# EAGLE design BSPD REV2 (EAGLE 9.6.2)
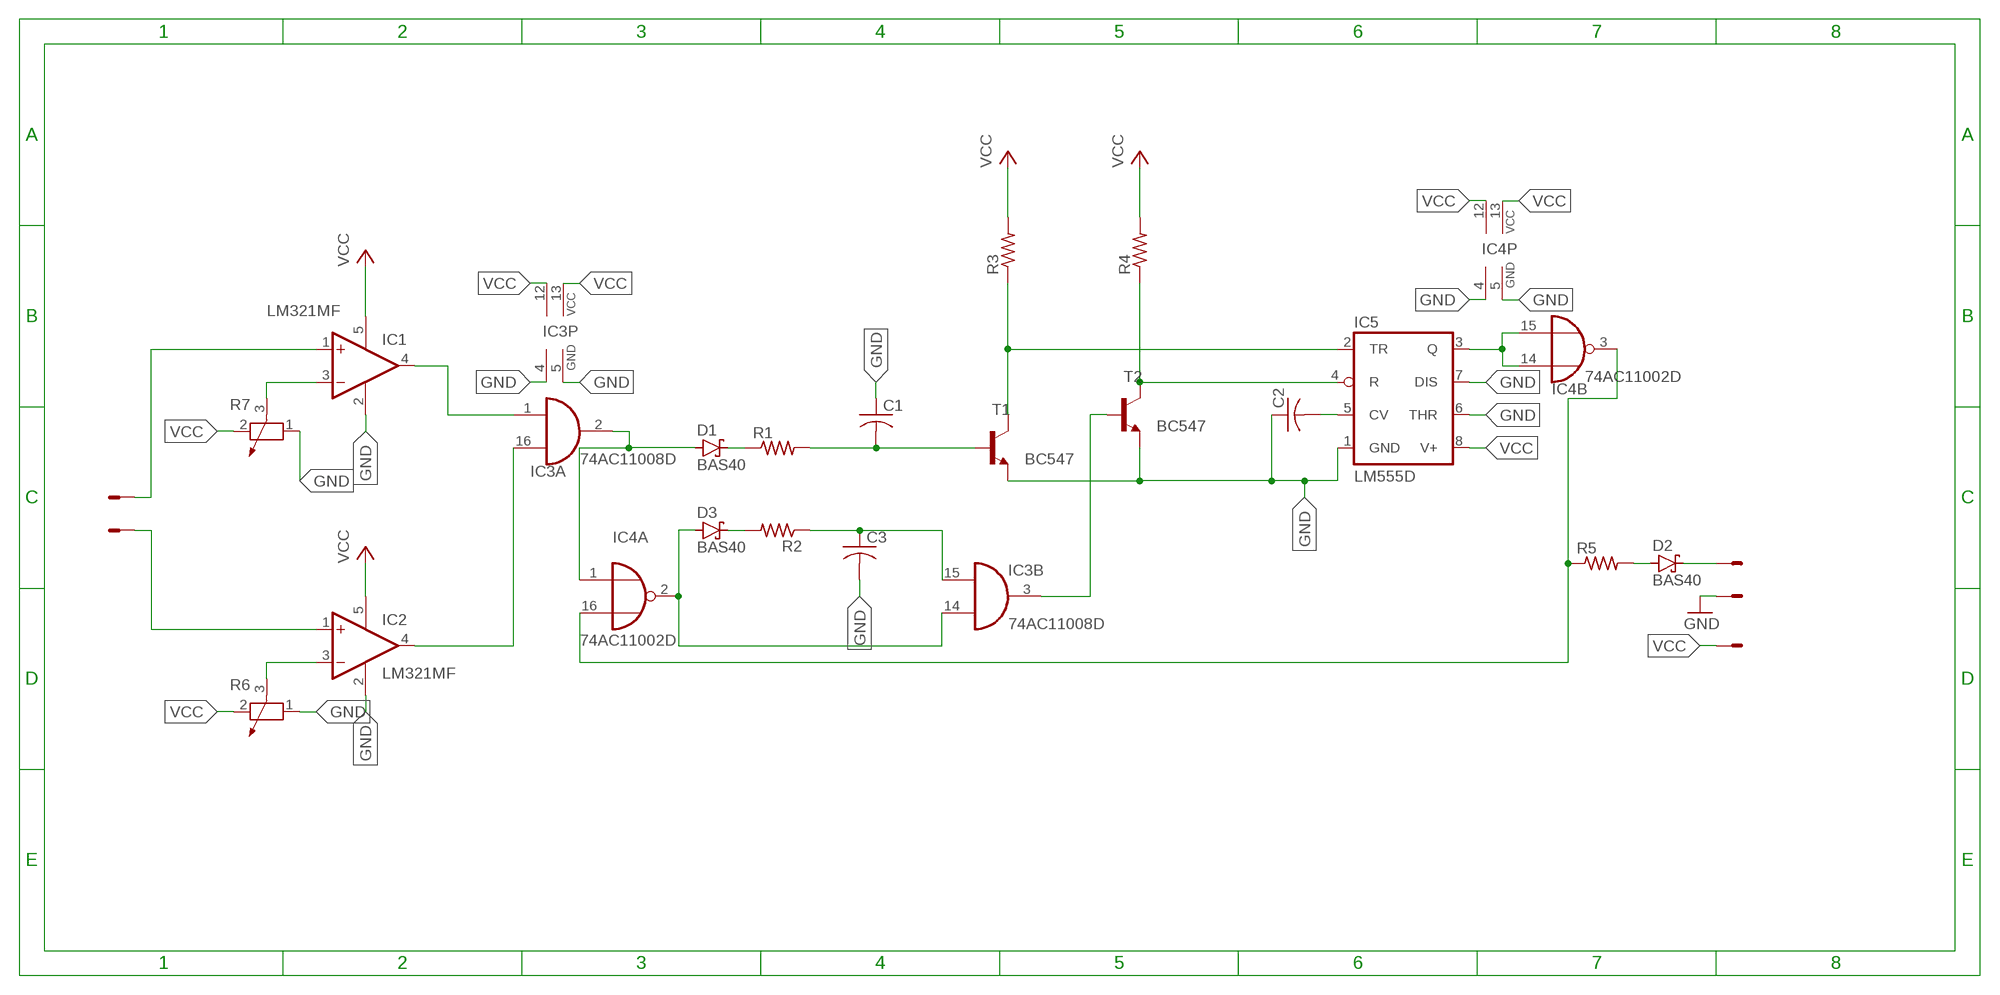
[diagram p0: schematic, sheet 1]

## Parts
C1  C-USC0402  [C0402]
C2  C-USC0402  [C0402]
C3  C-USC0402  [C0402]
D1  BAS40  [SOT23]
D2  BAS40  [SOT23]
D3  BAS40  [SOT23]
IC1  LM321MF  [SOT23-5]
IC2  LM321MF  [SOT23-5]
IC3  74AC11008D  [SO16]
IC4  74AC11002D  [SO16]
IC5  LM555D  [SO08]
R1  R-US_M1406  [M1406]
R2  R-US_M1406  [M1406]
R3  R-US_M1406  [M1406]
R4  R-US_M1406  [M1406]
R5  R-US_M1406  [M1406]
R6  POTENTIOMETER_PT_SPIN  [PT-SPIN]
R7  POTENTIOMETER_PT_SPIN  [PT-SPIN]
T1  BC547  [TO92]
T2  BC547  [TO92]
X1  22-23-2051  [22-23-2051]

## Nets
GND: C1.1 C2.1 C3.2 IC1.2(V-) IC2.2(V-) IC3.4(P:GND) IC3.5(P:GND) IC4.4(P:GND) IC4.5(P:GND) IC5.1(GND) IC5.6(THR) IC5.7(DIS) R6.1 R7.1 T1.1(E) T2.1(E) X1.2
N$1: IC1.1(+IN) X1.3
N$2: IC2.1(+IN) X1.4
N$3: IC1.3(-IN) R7.3
N$4: IC2.3(-IN) R6.3
N$5: IC1.4(OUT) IC3.1(A:I0)
N$6: IC2.4(OUT) IC3.16(A:I1)
N$7: D1.1(A) IC3.2(A:O) IC4.1(A:I0)
N$8: IC4.3(B:O) IC4.16(A:I1) R5.1
N$9: D1.3(C) R1.1
N$10: D3.1(A) IC3.14(B:I1) IC4.2(A:O)
N$11: D3.3(C) R2.2
N$12: C3.1 IC3.15(B:I0) R2.1
N$13: C1.2 R1.2 T1.2(B)
N$14: IC5.2(TR) R3.1 T1.3(C)
N$15: IC5.4(R) R4.1 T2.3(C)
N$17: D2.1(A) R5.2
N$18: IC3.3(B:O) T2.2(B)
N$19: C2.2 IC5.5(CV)
N$20: IC4.14(B:I1) IC4.15(B:I0) IC5.3(Q)
N$21: D2.3(C) X1.1
VCC: IC1.5(V+) IC2.5(V+) IC3.12(P:VCC) IC3.13(P:VCC) IC4.12(P:VCC) IC4.13(P:VCC) IC5.8(V+) R3.2 R4.2 R6.2 R7.2 X1.5
Unconnected: IC3.6(C:O) IC3.7(D:O) IC3.8(D:I1) IC3.9(D:I0) IC3.10(C:I1) IC3.11(C:I0) IC4.6(C:O) IC4.7(D:O) IC4.8(D:I1) IC4.9(D:I0) IC4.10(C:I1) IC4.11(C:I0)

## Library data of the parts
C1-C3 = adafruit:C-US: CAPACITOR, American symbol
D1-D3 = diode:BAS40: Silicon Schottky Diodes General-purpose diode for high-speed switching
IC1 IC2 = linear:LM321?*: Low Power Single Op Amp Source: http://cache.national.com/ds/LM/LM321.pdf
IC3 = 74ac-logic:74AC11008: Quadruple 2-input AND
IC4 = 74ac-logic:74AC11002: Quadruple 2-input NOR
IC5 = adafruit:*555: TIMER Changed DIP package to have round (not oval) pin pads http://www.ladyada.net/library/pcb/eaglelibrary.html
R1-R5 = adafruit:R-US_: RESISTOR, American symbol
R6 R7 = rcl:POTENTIOMETER_: Potentiometer; SPICEMODEL: POT; SPICEPREFIX: X
T1 T2 = transistor:BC547: NPN TRANSISTOR
X1 = con-molex:22-23-2051: .100" (2.54mm) Center Header - 5 Pin; MF: MOLEX; MPN: 22-23-2051; OC_FARNELL: 1462952; OC_NEWARK: 38C9178

## Board
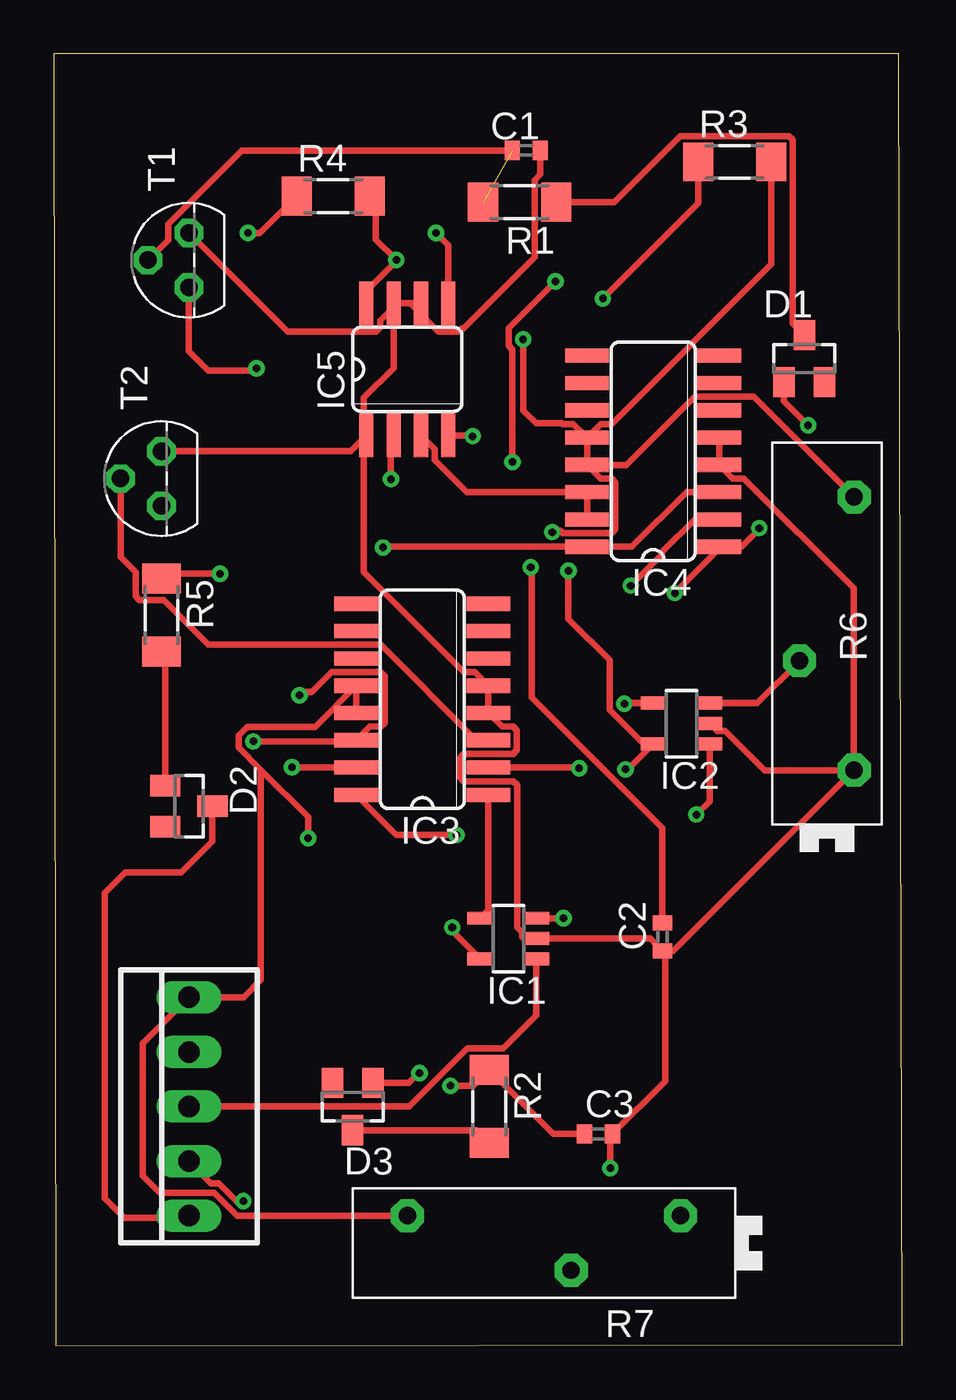
[diagram p1: board, top side]
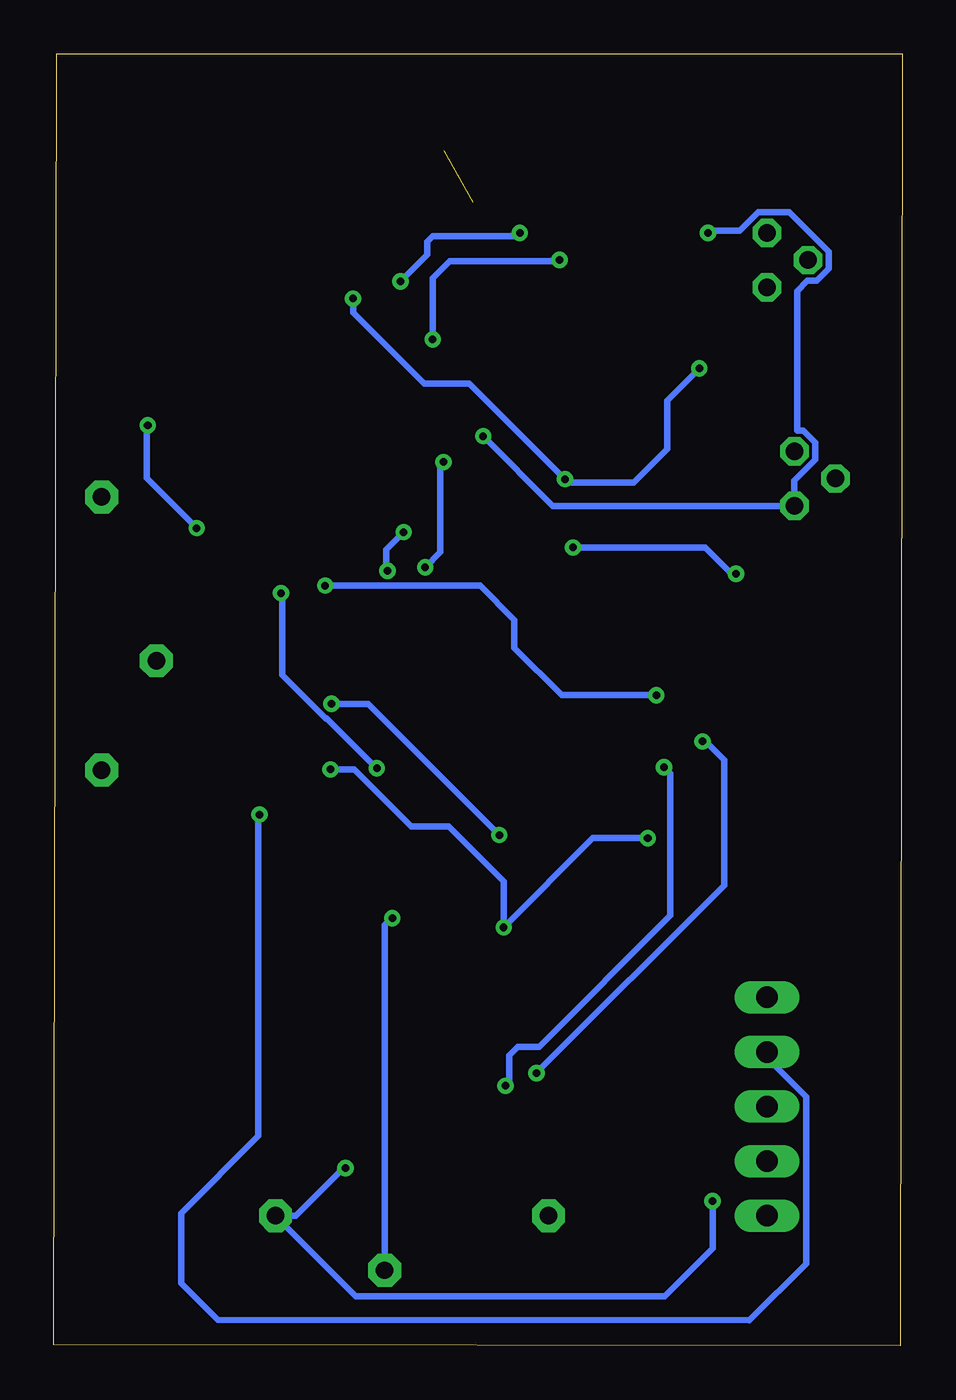
[diagram p2: board, bottom side, seen from below]

Size 39.45 x 60.1 mm. Coordinates in mm from the lower left corner, seen from the top.
Outline: 0.1,0 39.45,0.05 39.3,60.1 0,60.1 0.1,0
Copper layers (1*16): Top 0.035mm / dielectric 1.5mm / Bottom 0.035mm
Design rules "default": minimum track width 6mil, minimum drill 0.35mm, track to track 6mil, track to pad 6mil, pad to pad 6mil, via to via 6mil, smd to smd 6mil, copper to edge 40mil, drill to drill 6mil, minimum pad ring 10mil, minimum via ring 8mil, stop-mask expansion 4mil, vias tented up to drill 0mil, thermal gap 10mil

### Footprints (pad centres in the part's own frame; a part is rotated, then mirrored left to right if it is on the bottom)
C0402 = smd 0.7 x 0.9: 1 -0.65,0; 2 0.65,0
SOT23 = smd 1 x 1.4: 1 -0.95,-1.1; 2 0.95,-1.1; 3 0,1.1
SOT23-5 = smd 0.6 x 1.2: 1 -0.95,-1.306; 2 0,-1.306; 3 0.95,-1.306; 4 0.95,1.306; 5 -0.95,1.306
SO16 = smd 0.66 x 2.032: 1 -4.445,-3.073; 2 -3.175,-3.073; 3 -1.905,-3.073; 4 -0.635,-3.073; 5 0.635,-3.073; 6 1.905,-3.073; 7 3.175,-3.073; 8 4.445,-3.073; 9 4.445,3.073; 10 3.175,3.073; 11 1.905,3.073; 12 0.635,3.073; 13 -0.635,3.073; 14 -1.905,3.073; 15 -3.175,3.073; 16 -4.445,3.073
SO08 = smd 0.66 x 2.032: 1 -1.905,-3.073; 2 -0.635,-3.073; 3 0.635,-3.073; 4 1.905,-3.073; 5 1.905,3.073; 6 0.635,3.073; 7 -0.635,3.073; 8 -1.905,3.073
M1406 = smd 1.4 x 1.8: 1 -1.7,0; 2 1.7,0
PT-SPIN = drill 0.813 pad 1.524 octagon: 1 -6.35,-1.27; 2 6.35,-1.27; 3 -1.27,1.27
TO92 = drill 0.813 octagon: 1 1.27,0; 2 0,1.905; 3 -1.27,0
22-23-2051 = drill 1 long: 1 -5.08,0; 2 -2.54,0; 3 0,0; 4 2.54,0; 5 5.08,0

### Placement (x,y rotation side)
C1  21.97,55.6 180 top
C2  28.3,19.02 90 top
C3  25.33,9.86 0 top
D1  34.9,45.92 0 top
D2  6.28,25.1 270 top
D3  13.9,11.13 180 top
IC1  21.14,18.94 90 top
IC2  29.19,28.94 90 top
IC3  17.14,30.07 90 top
IC4  27.87,41.61 90 top
IC5  16.44,45.42 0 top
R1  21.66,53.2 180 top
R2  20.25,11.13 270 top
R3  31.66,55.07 0 top
R4  12.99,53.47 0 top
R5  5.01,33.99 270 top
R6  35.95,33.13 90 top
R7  22.79,4.78 180 top
T1  6.28,50.5 90 top
T2  5.01,40.34 90 top
X1  6.28,11.13 90 top

### Tracks (layer width: path | path; a pad name or v marks a point on that pad's centre or on a via)
GND  (via drill 0.35)
  Top 0.305: X1.2 7.3,7.57 7.66,7.57 8.72,6.51 8.81,6.6 v8.81,6.73 | v25.88,8.26 25.88,9.76 C3.2 28.43,12.31 28.43,18.32 28.38,18.37 | 28.38,18.37 C2.1 27.73,18.94 IC1.2 21.85,18.94 21.78,19.01 21.78,19.23 21.54,19.46 21.54,26.07 21.36,26.26 19.07,26.26 18.89,26.44 18.89,27.35 19.07,27.53 21.36,27.53 21.53,27.71 21.53,28.62 21.36,28.8 20.85,28.8 IC3.4 IC3.5 19.58,31.34 19.07,31.34 14.41,36 14.41,42.23 | 28.38,18.37 28.81,18.37 37.19,26.75 | 37.19,26.75 R6.1 | IC5.1 14.41,42.23 | 14.41,42.23 13.8,41.61 T2.1 | IC4.5 IC4.4 31.58,40.34 32.09,40.34 37.19,35.24 37.19,26.75 | IC2.2 30.84,28.59 31.22,28.59 33.07,26.75 37.19,26.75 | IC5.7 IC5.6 | IC5.7 15.81,48.31 | 15.81,48.31 15.81,45.48 14.41,44.09 14.41,42.23 | IC5.7 16.57,48.49 17.89,47.17 18.8,47.17 18.94,47.31 19.03,47.31 22.35,50.64 22.35,54.23 22.62,54.49 C1.1 | 15.81,48.31 15.17,47.67 15.17,47.35 14.99,47.17 10.88,47.17 T1.1
  Bottom 0.305: v8.81,6.73 8.81,4.53 11.03,2.31 25.4,2.31 R7.1 28.19,6.05 25.98,8.26 v25.88,8.26
N$1
  Top 0.305: X1.3 16.52,11.13 19.22,13.84 20.91,13.84 22.45,15.38 IC1.1
N$2  (via drill 0.35)
  Top 0.305: v29.88,24.71 30.5,25.33 IC2.1
  Bottom 0.305: X1.4 6.28,13.38 4.47,11.57 4.47,3.82 7.11,1.18 | 7.11,1.18 | 7.11,1.18 31.83,1.21 33.53,2.91 33.53,6.16 29.93,9.76 29.93,24.71 v29.88,24.71
N$3  (via drill 0.35)
  Top 0.305: v23.7,19.89 IC1.3
  Bottom 0.305: R7.3 24.06,19.58 23.73,19.91 v23.7,19.89
N$4
  Top 0.305: IC2.3 32.71,29.89 R6.3
N$5
  Top 0.305: IC1.4 20.21,20.27 IC3.1
N$6  (via drill 0.35)
  Top 0.305: IC3.16 15.93,23.76 v18.73,23.76 | v26.53,29.86 26.56,29.89 IC2.4
  Bottom 0.305: v18.73,23.76 24.83,29.86 v26.53,29.86
N$7  (via drill 0.35)
  Top 0.305: IC3.2 24.22,26.89 24.23,26.91 24.38,26.91 v24.43,26.86 | v28.88,35.01 30.94,37.07 IC4.1 31.98,37.17 32.83,38.01 v32.8,38.03 | v35.08,42.81 33.95,43.94 D1.1
  Bottom 0.305: v24.43,26.86 26.75,29.18 26.81,29.18 28.83,31.19 28.83,35.01 v28.88,35.01 | v32.8,38.03 35.13,40.36 35.13,42.76 v35.08,42.81
N$8  (via drill 0.35)
  Top 0.305: IC4.3 29.42,39.7 26.88,37.17 IC4.16 15.28,37.17 15.28,37.16 v15.31,37.14 | v7.73,35.91 5.23,35.91 R5.1
  Bottom 0.305: v15.31,37.14 9.15,37.14 7.88,35.86 7.78,35.86 v7.73,35.91
N$9
  Top 0.305: R1.1 26.06,53.2 29.13,56.28 34.19,56.28 34.36,56.1 34.36,47.56 D1.3
N$10  (via drill 0.35)
  Top 0.305: D3.1 16.5,12.23 16.98,12.71 v17.01,12.69 | v9.28,28.11 14.01,28.11 IC3.14 14.7,28.8 15.21,28.8 15.39,28.98 15.39,31.16 15.21,31.34 12.92,31.34 11.99,30.41 11.58,30.41 v11.43,30.26 | v26.83,35.36 28.28,36.81 28.28,36.91 29.8,38.44 IC4.2
  Bottom 0.305: v17.01,12.69 8.28,21.41 8.28,27.26 9.13,28.11 v9.28,28.11 | v11.43,30.26 15.83,30.26 18.03,32.46 18.03,33.76 19.63,35.36 v26.83,35.36
N$11
  Top 0.305: D3.3 19.65,10.03 R2.2
N$12  (via drill 0.35)
  Top 0.305: C3.1 23.22,9.86 R2.1 19.51,12.09 v18.45,12.09 | IC3.15 11.26,26.89 11.23,26.86 11.13,26.86 v11.08,26.91
  Bottom 0.305: v11.08,26.91 10.78,26.61 10.78,20.01 16.88,13.91 17.88,13.91 18.28,13.51 18.28,12.26 v18.45,12.09
N$13  (1 unrouted)
  Top 0.305: T1.2 5.31,51.44 5.31,52.17 8.74,55.6 C1.2
N$14  (via drill 0.35)
  Top 0.305: T1.3 6.28,46.26 7.18,45.36 9.43,45.36 v9.43,45.46 | v15.68,40.31 15.68,42.22 IC5.2 | v25.53,48.71 29.96,53.14 R3.1
  Bottom 0.305: v9.43,45.46 10.93,43.96 10.93,41.71 12.48,40.16 15.43,40.16 15.63,40.36 v15.68,40.31 20.13,44.76 22.23,44.76 25.53,48.06 v25.53,48.71
N$15  (via drill 0.35)
  Top 0.305: IC5.4 19.29,42.35 19.38,42.26 19.43,42.26 v19.48,42.31 | v9.03,51.76 9.58,51.76 R4.1
  Bottom 0.305: v19.48,42.31 16.24,39.07 T2.3 5.01,40.25 4.04,41.21 4.04,42.01 4.61,42.58 4.88,42.58 4.88,49.06 4.4,49.53 3.97,49.53 3.41,50.1 3.41,50.9 5.24,52.73 6.68,52.73 7.55,51.86 8.93,51.86 v9.03,51.76
N$17
  Top 0.305: D2.1 5.18,32.12 R5.2
N$18
  Top 0.305: IC3.3 19.65,28.16 15.21,32.61 7.18,32.61 5.11,34.69 3.98,34.69 3.8,34.86 3.8,35.98 3.11,36.69 T2.2
N$19  (via drill 0.35)
  Top 0.305: C2.2 28.3,24.09 22.23,30.16 22.23,36.16 v22.18,36.21 | v21.33,41.11 21.33,46.34 21.15,46.53 21.15,47.33 v23.33,49.51 | v17.78,51.76 18.34,51.19 IC5.5
  Bottom 0.305: v22.18,36.21 21.48,36.91 21.48,41.11 v21.33,41.11 | v23.33,49.51 22.08,50.76 22.08,51.36 21.83,51.61 17.93,51.61 v17.78,51.76
N$20
  Top 0.305: IC4.15 IC4.14 19.21,39.7 17.71,41.2 17.71,41.71 IC5.3
N$21
  Top 0.305: D2.3 7.38,23.46 5.93,22.01 3.32,22.01 2.37,21.06 2.37,6.86 3.27,5.96 6.19,5.96 X1.1
VCC  (via drill 0.35)
  Top 0.305: R7.2 8.53,6.05 7.47,7.11 4.93,7.11 4.13,7.91 4.13,14.06 X1.5 8.83,16.21 9.63,17.01 9.63,26.79 | IC3.13 IC3.12 12.15,28.79 9,28.79 8.6,28.39 8.6,27.83 9.63,26.79 | IC4.13 IC4.12 | v18.53,19.46 18.53,19.29 IC1.5 | v11.83,23.61 11.83,24.59 9.63,26.79 | IC4.13 26.63,40.97 29.8,44.15 32.55,44.15 R6.2 | IC4.13 25.43,40.34 25.94,40.34 26.12,40.16 26.12,37.98 25.94,37.8 23.65,37.8 23.54,37.91 23.18,37.91 v23.18,37.85 | v23.93,36.04 23.93,33.81 25.85,31.89 25.85,29.58 27.43,27.99 IC2.5 26.83,26.94 26.83,26.81 v26.58,26.81 | IC4.12 25.43,42.88 25.94,42.88 33.36,50.3 R3.2 | IC4.12 24.16,42.88 23.65,42.88 23.62,42.91 22.43,42.91 21.83,43.51 v21.83,46.81 | IC5.8 14.53,49.06 15.93,50.46 v15.93,50.51 14.98,51.46 14.98,53.18 R4.2
  Bottom 0.305: v11.83,23.61 14.38,23.61 v18.53,19.46 18.53,21.61 21.08,24.16 22.83,24.16 25.48,26.81 v26.58,26.81 | v23.18,37.85 23.98,37.05 23.98,36.01 23.96,36.01 v23.93,36.04 | v21.83,46.81 21.83,49.66 21.03,50.46 15.93,50.46 v15.93,50.51